# EAGLE design Board OLED (EAGLE 6.5.0)
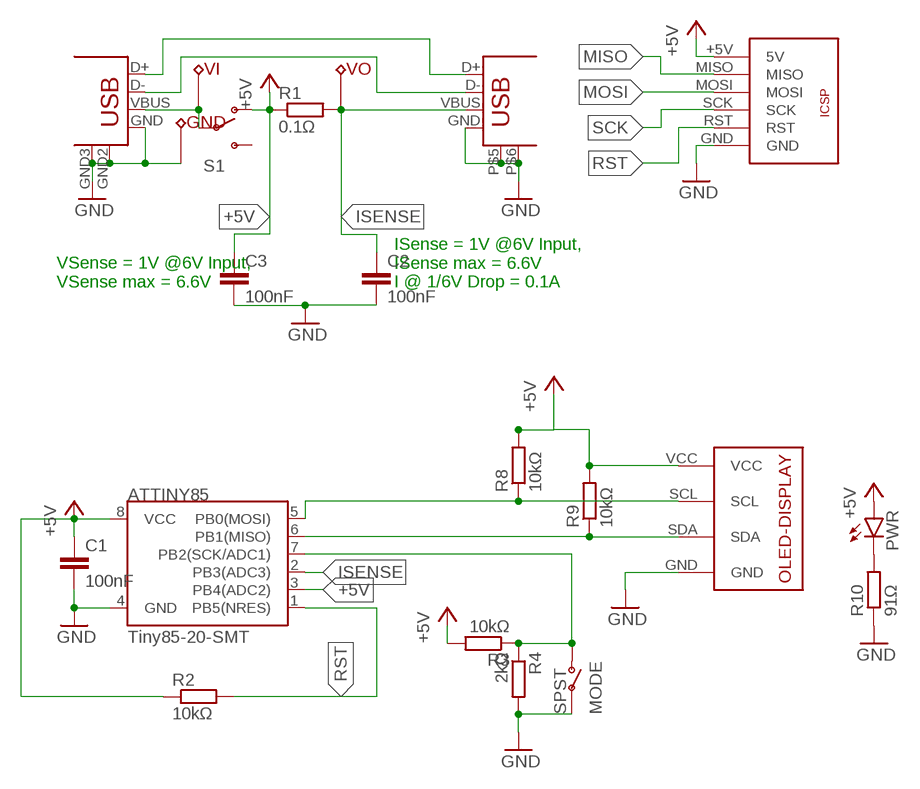
[diagram p0: schematic, sheet 1]

## Parts
ATTINY85  Tiny85-20-SMT  ATTINY45TINY85-20-SMT  [SO08-EIAJ]
C1  100nF  C-EUC0603  [C0603]
C2  100nF  C-EUC0603  [C0603]
C3  100nF  C-EUC0603  [C0603]
GND  TESTPOINT0.5MM-DRILL-WIRE-LOOP  [TP-0.5MM-DUAL]
INPUT  USB+SHIELDTHROUGHHOLE-MALE  [USB-A-H]
MODE  SPST  [WUERTH-SPST-SMD]
OUTPUT  USB+SHIELDTHROUGHOLE-FEMALE  [USB-A-S-SILK-THROUGHHOLE]
PWR  LED0603  [LED-0603]
R1  0.1Ω  R-EU_R2512  [R2512]
R2  10kΩ  R-EU_R0603  [R0603]
R3  10kΩ  R-EU_R0603  [R0603]
R4  2kΩ  R-EU_R0603  [R0603]
R8  10kΩ  R-EU_R0603  [R0603]
R9  10kΩ  R-EU_R0603  [R0603]
R10  91Ω  R-EU_R0603  [R0603]
S1  SWITCH-SPDT-SMD-A  [SWITCH-SPST-SMD-A]
U$1  ICSPSMD  [ICSP-SMD]
U$2  OLED-I2C  [OLED-I2C]
VI  TESTPOINT0.5MM-DRILL-WIRE-LOOP  [TP-0.5MM-DUAL]
VO  TESTPOINT0.5MM-DRILL-WIRE-LOOP  [TP-0.5MM-DUAL]

## Nets
+5V: ATTINY85.3(PB4(ADC2)) ATTINY85.8(VCC) C1.1 C3.1 PWR.A R1.1 R2.1 R3.2 R8.2 R9.2 S1.1(O) U$1.+5V(5V) U$2.VCC
GND: ATTINY85.4(GND) C1.2 C2.2 C3.2 GND.P$1(TP) GND.P$2(TP) INPUT.GND INPUT.GND2(S1) INPUT.GND3(S2) MODE.1(P) MODE.3(P) OUTPUT.GND OUTPUT.P$5(S1) OUTPUT.P$6(S2) R4.2 R10.1 U$1.GND U$2.GND
ISENSE: ATTINY85.2(PB3(ADC3)) C2.1 OUTPUT.VBUS R1.2 VO.P$1(TP) VO.P$2(TP)
MISO: ATTINY85.6(PB1(MISO)) R9.1 U$1.MISO U$2.SDA
MOSI: ATTINY85.5(PB0(MOSI)) R8.1 U$1.MOSI U$2.SCL
N$1: INPUT.D+ OUTPUT.D+
N$2: INPUT.D- OUTPUT.D-
N$3: INPUT.VBUS S1.2(P) VI.P$1(TP) VI.P$2(TP)
N$4: PWR.C R10.2
RST: ATTINY85.1(PB5(NRES)) R2.2 U$1.RST
SCK: ATTINY85.7(PB2(SCK/ADC1)) MODE.2(O) MODE.4(O) R3.1 R4.1 U$1.SCK
Unconnected: S1.3(S)

## Notes on the sheet
- VSense = 1V @6V Input, 
  VSense max = 6.6V
- ISense = 1V @6V Input, 
  ISense max = 6.6V
  I @ 1/6V Drop = 0.1A

## Library data of the parts
ATTINY85 = SparkFun-DigitalIC:ATTINY45: Atmel 8-pin 2/4/8kB flash uC; PROD_ID: IC-09092
C1-C3 = rcl:C-EU: CAPACITOR, European symbol
GND VI VO = OwnStuff:TESTPOINT
INPUT OUTPUT = SparkFun-Connectors:USB+SHIELD: USB+Shield USB connector with shield pins connectable
MODE = OwnStuff:SPST
PWR = SparkFun-LED:LED: LEDs Standard schematic elements and footprints for 5mm, 3mm, 1206, and 0603 sized LEDs. 5mm - Spark Fun Electronics SKU : COM-00529 (and others)
R1-R4 R8-R10 = rcl:R-EU_: RESISTOR, European symbol
S1 = SparkFun-Electromechanical:SWITCH-SPDT: SPDT Switch Simple slide switch, Spark Fun Electronics SKU : COM-00102 DPDT SMT slide switch, AYZ0202, SWCH-08179
U$1 = OwnStuff:ICSP
U$2 = OwnStuff:OLED-I2C

## Board
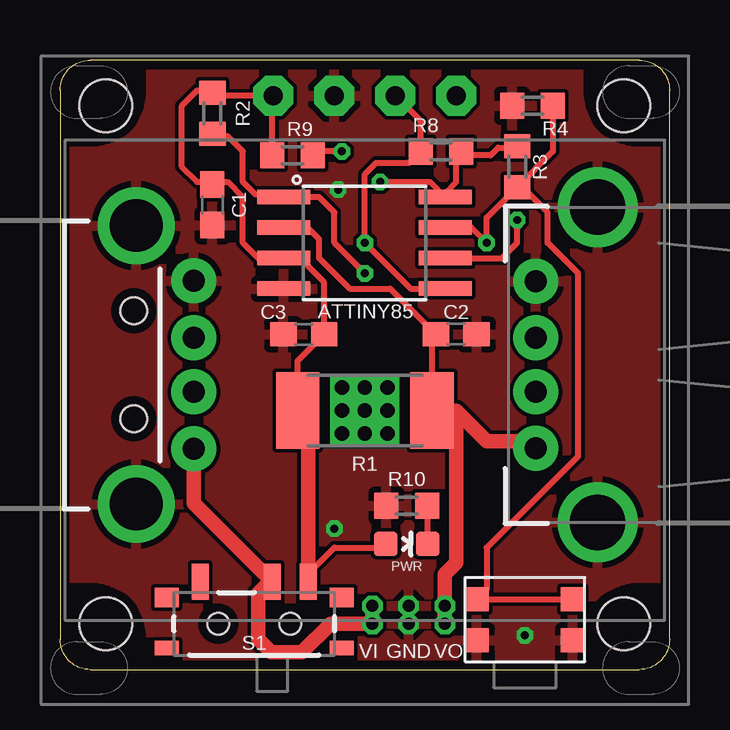
[diagram p1: board, top side]
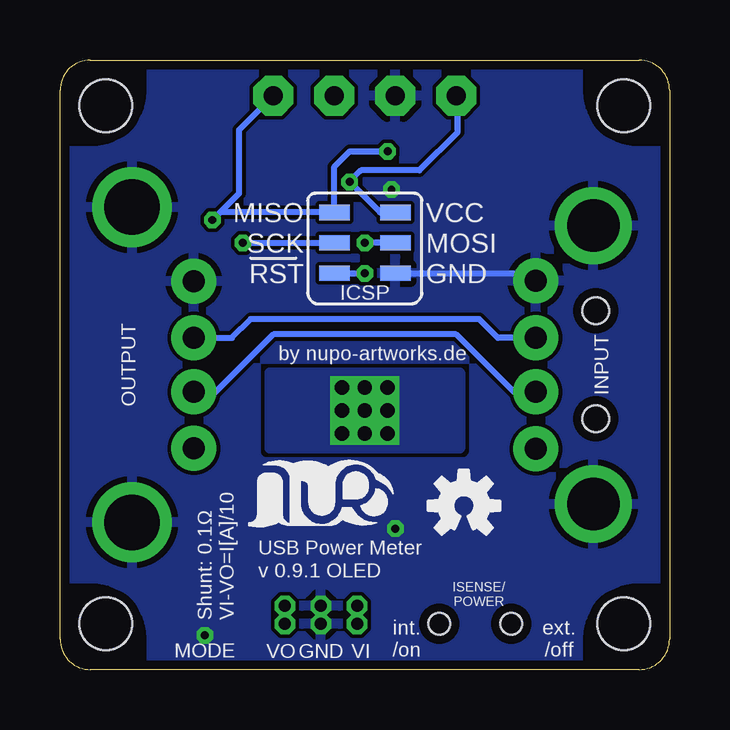
[diagram p2: board, bottom side, seen from below]

Size 25.4 x 25.4 mm. Coordinates in mm from the lower left corner, seen from the top.
Outline: 1.27,0 24.13,0 arc90 25.4,1.27 25.4,24.13 arc90 24.13,25.4 1.27,25.4 arc90 0,24.13 0,1.27 arc90 1.27,0
Copper layers (1*16): Top 0.0356mm / dielectric 1.5011mm / Bottom 0.0356mm
Design rules "LaenPCBOrder-2 *": minimum track width 6mil, minimum drill 13mil, track to track 6mil, track to pad 6mil, pad to pad 6mil, via to via 6mil, smd to smd 6mil, copper to edge 15mil, drill to drill 6mil, minimum pad ring 7mil, minimum via ring 7mil, stop-mask expansion 3mil, vias tented up to drill 13mil, thermal gap 10mil
Holes 2.2 mm at 1.91,23.5 23.5,23.5 23.5,1.91 1.91,1.91

### Footprints (pad centres in the part's own frame; a part is rotated, then mirrored left to right if it is on the bottom)
SO08-EIAJ = smd 0.61 x 2.21: 1 -1.905,-3.378; 2 -0.635,-3.378; 3 0.635,-3.378; 4 1.905,-3.378; 5 1.905,3.353; 6 0.635,3.353; 7 -0.635,3.353; 8 -1.905,3.353
C0603 = smd 1.1 x 1: 1 -0.85,0; 2 0.85,0
TP-0.5MM-DUAL = drill 0.5 octagon: P$1 0,0; P$2 0,0.75
USB-A-H = drill 0.914 pad 1.88: D+ 2.4,1.127; D- 2.4,-1.127; GND 2.4,3.5; VBUS 2.4,-3.5 | drill 2.2: GND2 0,-5.8; GND3 0,5.8 | hole 1.1: -0.1,2.25; -0.1,-2.25
WUERTH-SPST-SMD = smd 1 x 1: 1 2,-1; 2 2,0.7; 3 -2,-1; 4 -2,0.7
USB-A-S-SILK-THROUGHHOLE = drill 0.914 pad 1.88: D+ 3.035,-1.127; D- 3.035,1.127; GND 3.035,-3.485; VBUS 3.035,3.485 | drill 2.311: P$5 0.46,-6.566; P$6 0.46,6.566
LED-0603 = smd 1 x 1: A 0,-0.877; C 0,0.877
R2512 = smd 1.8 x 3.2: 1 -2.8,0; 2 2.8,0
R0603 = smd 1 x 1.1: 1 -0.85,0; 2 0.85,0
SWITCH-SPST-SMD-A = smd 0.7 x 1.5: 1 -2.25,-1.75; 2 -0.75,-1.75; 3 2.25,-1.75 | smd 1 x 0.6: GND1 -3.65,1; GND3 3.65,1 | smd 1 x 0.8: GND2 -3.65,-1.1; GND4 3.65,-1.1 | hole 0.9: -1.5,0; 1.5,0
ICSP-SMD = smd 1.27 x 0.635: +5V 1.27,1.27; GND 1.27,-1.27; MISO -1.27,1.27; MOSI 1.27,0; RST -1.27,-1.27; SCK -1.27,0
OLED-I2C = drill 0.8 pad 1.676 octagon: GND -1.27,11.85; SCL 1.27,11.85; SDA 3.81,11.85; VCC -3.81,11.85

### Placement (x,y rotation side)
ATTINY85  12.7,17.78 270 top
C1  6.35,19.37 270 top
C2  16.51,13.97 0 top
C3  10.16,13.97 180 top
GND  14.53,1.91 0 top
INPUT  3.17,12.7 0 top
MODE  19.37,2.22 0 top
OUTPUT  22.86,12.7 180 top
PWR  14.45,5.24 270 top
R1  12.7,10.79 0 top
R2  6.35,23.18 270 top
R3  19.05,20.95 90 top
R4  19.68,23.5 180 top
R8  15.88,21.59 0 top
R9  9.68,21.43 180 top
R10  14.45,6.83 0 top
S1  8.1,1.91 180 top
U$1  12.7,17.78 0 bottom
U$2  12.7,12.06 0 top
U$3  [LOGO-SILKSCREEEN-S]  14.61,6.83 0 bottom
U$4  [OSHW-LOGO-S]  8.57,6.83 0 bottom
VI  13.02,1.91 0 top
VO  16.03,1.91 0 top

### Tracks (layer width: path | path; a pad name or v marks a point on that pad's centre or on a via)
+5V  (via drill 0.33)
  Top 0.254: S1.1 10.35,4 11.43,5.08 13.41,5.08 PWR.A | R1.1 9.9,12.86 C3.1 11.01,16.14 10.16,16.99 9.48,16.99 | 9.48,16.99 ATTINY85.3 | 9.48,16.99 8.41,16.99 7.62,17.78 7.62,19.68 6.99,20.32 6.35,20.32 | 6.35,20.32 5.71,20.32 5.08,20.95 5.08,23.5 5.71,24.13 6.25,24.13 R2.1 6.46,23.91 U$2.VCC 8.83,23.86 R9.2 | R3.2 18.99,21.75 18.26,21.75 17.94,21.43 16.88,21.43 R8.2 16.51,21.38 16.51,20.32 16.09,19.9 16.09,19.72 ATTINY85.8 15.42,20.32 v13.34,20.32 | C1.1 6.35,20.32
  Top 0.61: S1.1 10.35,10.35 R1.1
  Bottom 0.254: U$2.VCC 8.83,23.86 8.83,22.38 10.42,20.8 12.86,20.8 v13.34,20.32 12.06,19.05 U$1.+5V
GND  (via drill 0.33)
  Bottom 0.254: U$1.GND 5.88,16.51 INPUT.GND
  other vias: 19.37,1.43 11.43,5.87 11.59,20
  pour Bottom (rank 2): 3.81,0 3.81,1.27 arc90 1.27,3.81 0,3.81 0,21.59 1.27,21.59 arc90 3.81,24.13 3.81,25.4 21.59,25.4 21.59,24.13 arc90 24.13,21.59 25.4,21.59 25.4,3.81 24.13,3.81 arc90 21.59,1.27 21.59,0
  pour Top: 0,3.81 0,21.59 1.27,21.59 arc90 3.81,24.13 3.81,25.4 21.59,25.4 21.59,24.13 arc90 24.13,21.59 25.4,21.59 25.4,3.81 24.13,3.81 arc90 21.59,1.27 21.59,0 3.81,0 3.81,1.27 arc90 1.27,3.81
ISENSE
  Top 0.254: R1.2 15.5,13.81 C2.1 13.76,15.88 12.06,15.88 10.79,17.14 10.79,17.94 10.32,18.41 ATTINY85.2
  Top 0.61: VO.P$1 VO.P$2 16.03,3.97 16.51,4.45 16.51,10.79 | 16.03,10.26 R1.2 16.51,10.79 | 16.51,10.79 17.78,9.53 19.52,9.53 OUTPUT.VBUS
MISO  (via drill 0.33)
  Top 0.254: ATTINY85.6 18.41,17.14 19.05,17.78 v19.05,18.73 | v11.75,21.59 10.69,21.59 R9.1
  Bottom 0.254: 18.73,19.05 U$1.MISO 13.97,20.95 13.34,21.59 v11.75,21.59 | 18.73,19.05 v19.05,18.73 | 18.73,19.05 17.94,19.84 17.94,22.49 U$2.SDA
MOSI  (via drill 0.33)
  Top 0.254: ATTINY85.5 14.61,15.88 v12.7,17.78 12.7,20.64 13.18,21.11 14.55,21.11 R8.1 15.03,22.86 U$2.SCL 13.65,23.6 13.65,23.34
  Bottom 0.254: U$1.MOSI v12.7,17.78
N$1
  Bottom 0.254: 5.54,13.83 INPUT.D+ 7.16,13.83 7.94,14.61 17.46,14.61 18.24,13.83 OUTPUT.D+ 19.86,13.83
N$2
  Bottom 0.254: INPUT.D- 6.49,11.57 8.89,13.97 16.51,13.97 19.05,11.43 19.68,11.43 OUTPUT.D-
N$3
  Top 0.61: VI.P$2 VI.P$1 11.27,1.91 10.08,0.71 8.81,0.71 8.26,1.27 8.26,3.17 8.73,3.65 S1.2 5.58,6.93 INPUT.VBUS
N$4
  Top 0.254: PWR.C 15.32,6.8 R10.2
RST  (via drill 0.33)
  Top 0.254: v12.7,16.51 11.43,17.78 11.43,19.05 10.79,19.68 ATTINY85.1 9.22,19.79 8.15,19.79 7.62,20.32 7.62,21.59 6.99,22.23 6.45,22.23 R2.2
  Bottom 0.254: U$1.RST v12.7,16.51
SCK  (via drill 0.33)
  Top 0.254: MODE.2 MODE.4 17.78,3.33 17.78,5.08 21.59,8.89 21.59,16.51 20.32,17.78 20.32,19.05 19.05,20.32 R3.1 | ATTINY85.7 17.14,18.41 v17.78,17.78 17.78,18.84 R3.1 | R4.1 20.54,21.59 R3.1
  Bottom 0.254: v17.78,17.78 U$1.SCK
THERM  (via drill 0.6)
  other vias: 11.75,11.75 12.7,11.75 13.65,11.75 11.75,10.79 12.7,10.79 13.65,10.79 11.75,9.84 12.7,9.84 13.65,9.84
  pour Bottom (no thermals): 8.73,12.38 8.73,9.21 16.67,9.21 16.67,12.38

### Text on the board
bNames: by nupo-artworks.de | USB Power Meter | ISENSE/ / POWER | v 0.9.1 OLED | ext. / /off | int. / /on | Shunt: 0.1Ω / VI-VO=I[A]/10 | VI | GND | VO | MODE